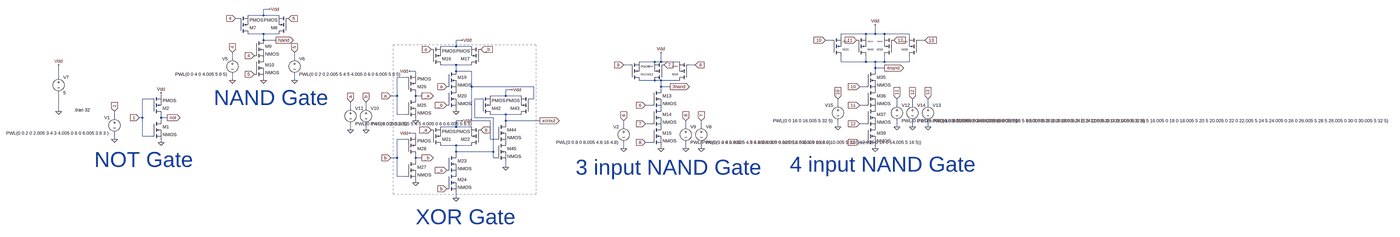
[diagram p0: schematic Basic Gates using CMOS.asc, whole sheet]
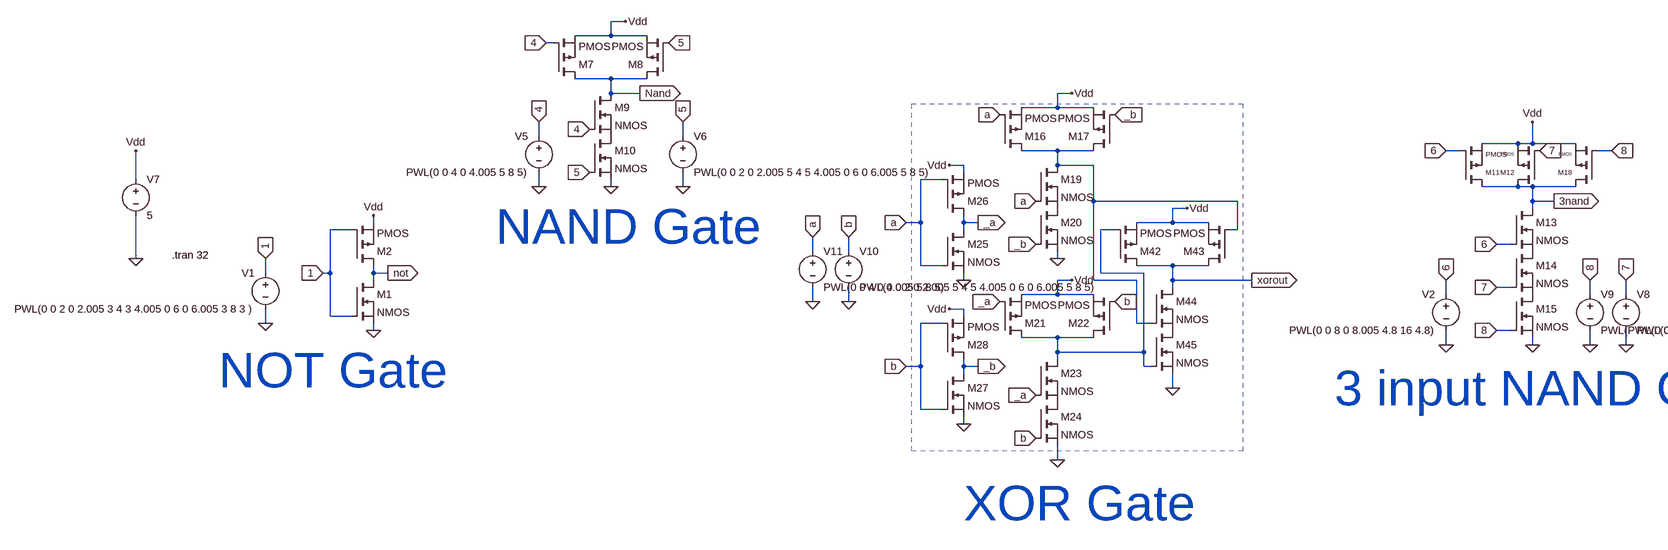
[diagram p1: schematic Basic Gates using CMOS.asc, part, row 1 of 1, column 1 of 2]
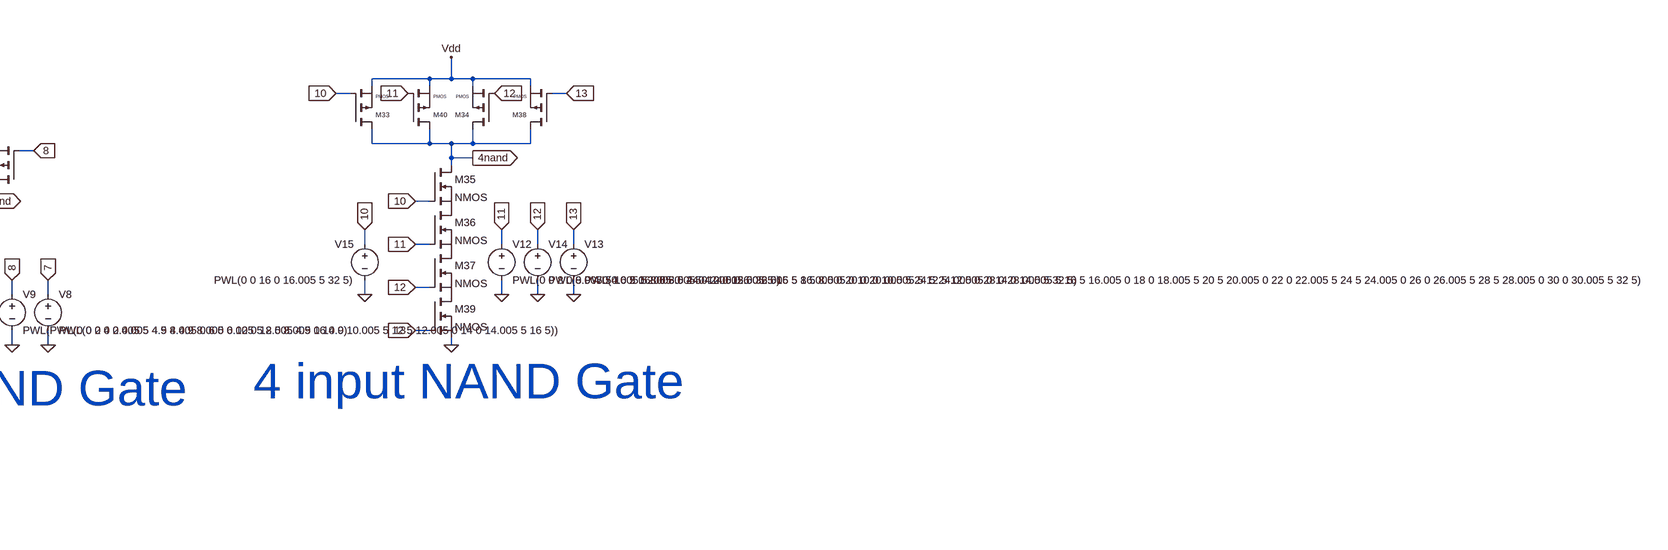
[diagram p2: schematic Basic Gates using CMOS.asc, part, row 1 of 1, column 2 of 2]
Basic Gates using CMOS.asc, the LTspice schematic file:
Version 4
SHEET 1 7632 1456
WIRE 1456 -784 1424 -784
WIRE 1424 -752 1424 -784
WIRE 1424 -752 1344 -752
WIRE 1504 -752 1424 -752
WIRE 1296 -736 1280 -736
WIRE 1424 -656 1344 -656
WIRE 1504 -656 1424 -656
WIRE 4528 -656 4400 -656
WIRE 4576 -656 4576 -704
WIRE 4576 -656 4528 -656
WIRE 4624 -656 4576 -656
WIRE 4752 -656 4624 -656
WIRE 4400 -640 4400 -656
WIRE 4528 -640 4528 -656
WIRE 4624 -640 4624 -656
WIRE 4752 -640 4752 -656
WIRE 1424 -624 1424 -656
WIRE 1488 -624 1424 -624
WIRE 2448 -624 2416 -624
WIRE 4352 -624 4320 -624
WIRE 4832 -624 4800 -624
WIRE 2416 -592 2416 -624
WIRE 2416 -592 2336 -592
WIRE 2496 -592 2416 -592
WIRE 1264 -528 1264 -560
WIRE 1584 -528 1584 -560
WIRE 3440 -512 3360 -512
WIRE 3472 -512 3472 -560
WIRE 3472 -512 3440 -512
WIRE 3568 -512 3472 -512
WIRE 4400 -512 4400 -544
WIRE 4528 -512 4528 -544
WIRE 4528 -512 4400 -512
WIRE 4576 -512 4528 -512
WIRE 4624 -512 4624 -544
WIRE 4624 -512 4576 -512
WIRE 4752 -512 4752 -544
WIRE 4752 -512 4624 -512
WIRE 2416 -496 2336 -496
WIRE 2496 -496 2416 -496
WIRE 3312 -496 3280 -496
WIRE 3648 -496 3616 -496
WIRE 4576 -480 4576 -512
WIRE 4624 -480 4576 -480
WIRE 2208 -464 2176 -464
WIRE 2416 -464 2416 -496
WIRE 2496 -464 2416 -464
WIRE 4576 -464 4576 -480
WIRE 2208 -448 2208 -464
WIRE 368 -432 368 -496
WIRE 2160 -432 2112 -432
WIRE 1264 -416 1264 -448
WIRE 1424 -416 1424 -432
WIRE 1584 -416 1584 -448
WIRE 3440 -416 3360 -416
WIRE 3472 -416 3440 -416
WIRE 3568 -416 3472 -416
WIRE 2496 -384 2496 -464
WIRE 2816 -384 2496 -384
WIRE 3472 -384 3472 -416
WIRE 3520 -384 3472 -384
WIRE 4528 -384 4496 -384
WIRE 2704 -368 2672 -368
WIRE 3472 -368 3472 -384
WIRE 896 -336 896 -352
WIRE 2112 -336 2112 -432
WIRE 2112 -336 2080 -336
WIRE 2208 -336 2208 -352
WIRE 2240 -336 2208 -336
WIRE 2672 -336 2672 -368
WIRE 2672 -336 2592 -336
WIRE 2752 -336 2672 -336
WIRE 848 -320 800 -320
WIRE 2208 -320 2208 -336
WIRE 2544 -320 2512 -320
WIRE 2816 -320 2816 -384
WIRE 2816 -320 2800 -320
WIRE 3424 -288 3392 -288
WIRE 4384 -288 4384 -320
WIRE 4528 -288 4496 -288
WIRE 4688 -288 4688 -320
WIRE 4768 -288 4768 -320
WIRE 4848 -288 4848 -320
WIRE 1872 -272 1872 -304
WIRE 1952 -272 1952 -304
WIRE 368 -256 368 -352
WIRE 2416 -256 2416 -272
WIRE 2112 -240 2112 -336
WIRE 2160 -240 2112 -240
WIRE 2672 -240 2592 -240
WIRE 2752 -240 2672 -240
WIRE 656 -224 656 -256
WIRE 800 -224 800 -320
WIRE 800 -224 784 -224
WIRE 896 -224 896 -240
WIRE 928 -224 896 -224
WIRE 2512 -224 2512 -320
WIRE 2608 -224 2512 -224
WIRE 896 -208 896 -224
WIRE 2208 -208 2208 -224
WIRE 2448 -208 2416 -208
WIRE 2496 -208 2496 -384
WIRE 2592 -208 2496 -208
WIRE 2672 -208 2672 -240
WIRE 2848 -208 2672 -208
WIRE 2672 -192 2672 -208
WIRE 3424 -192 3392 -192
WIRE 4528 -192 4496 -192
WIRE 2416 -176 2416 -208
WIRE 2416 -176 2336 -176
WIRE 2496 -176 2416 -176
WIRE 3280 -176 3280 -208
WIRE 3600 -176 3600 -208
WIRE 3680 -176 3680 -208
WIRE 4384 -176 4384 -208
WIRE 4688 -176 4688 -208
WIRE 4768 -176 4768 -208
WIRE 4848 -176 4848 -208
WIRE 1872 -160 1872 -192
WIRE 1952 -160 1952 -192
WIRE 2208 -144 2176 -144
WIRE 800 -128 800 -224
WIRE 848 -128 800 -128
WIRE 2208 -128 2208 -144
WIRE 656 -112 656 -144
WIRE 2160 -112 2112 -112
WIRE 2592 -112 2592 -208
WIRE 2624 -112 2592 -112
WIRE 896 -96 896 -112
WIRE 3424 -96 3392 -96
WIRE 4528 -96 4496 -96
WIRE 2416 -80 2336 -80
WIRE 2496 -80 2416 -80
WIRE 3280 -64 3280 -96
WIRE 3472 -64 3472 -80
WIRE 3600 -64 3600 -96
WIRE 3680 -64 3680 -96
WIRE 4576 -64 4576 -80
WIRE 2416 -48 2416 -80
WIRE 2608 -48 2608 -224
WIRE 2608 -48 2416 -48
WIRE 2416 -32 2416 -48
WIRE 2112 -16 2112 -112
WIRE 2112 -16 2080 -16
WIRE 2208 -16 2208 -32
WIRE 2240 -16 2208 -16
WIRE 2608 -16 2608 -48
WIRE 2624 -16 2608 -16
WIRE 2208 0 2208 -16
WIRE 2672 32 2672 0
WIRE 2112 80 2112 -16
WIRE 2160 80 2112 80
WIRE 2208 112 2208 96
WIRE 2416 192 2416 160
FLAG 1264 -416 0
FLAG 1584 -416 0
FLAG 1264 -560 4
IOPIN 1264 -560 In
FLAG 1584 -560 5
IOPIN 1584 -560 In
FLAG 896 -96 0
FLAG 896 -352 Vdd
FLAG 928 -224 not
IOPIN 928 -224 Out
FLAG 784 -224 1
IOPIN 784 -224 In
FLAG 656 -112 0
FLAG 656 -256 1
IOPIN 656 -256 In
FLAG 368 -256 0
FLAG 368 -496 Vdd
FLAG 3280 -64 0
FLAG 3680 -64 0
FLAG 3280 -208 6
IOPIN 3280 -208 In
FLAG 3680 -208 7
IOPIN 3680 -208 In
FLAG 3600 -64 0
FLAG 3600 -208 8
IOPIN 3600 -208 In
FLAG 1952 -160 0
FLAG 1952 -304 b
IOPIN 1952 -304 In
FLAG 1872 -160 0
FLAG 1872 -304 a
IOPIN 1872 -304 In
FLAG 3472 -560 Vdd
FLAG 3280 -496 6
IOPIN 3280 -496 In
FLAG 3488 -496 7
IOPIN 3488 -496 In
FLAG 3520 -384 3nand
IOPIN 3520 -384 Out
FLAG 3392 -192 7
IOPIN 3392 -192 In
FLAG 3392 -288 6
IOPIN 3392 -288 In
FLAG 3472 -64 0
FLAG 3392 -96 8
IOPIN 3392 -96 In
FLAG 3648 -496 8
IOPIN 3648 -496 In
FLAG 4688 -176 0
FLAG 4848 -176 0
FLAG 4688 -320 11
IOPIN 4688 -320 In
FLAG 4848 -320 13
IOPIN 4848 -320 In
FLAG 4768 -176 0
FLAG 4768 -320 12
IOPIN 4768 -320 In
FLAG 4576 -704 Vdd
FLAG 4320 -624 10
IOPIN 4320 -624 In
FLAG 4672 -624 12
IOPIN 4672 -624 In
FLAG 4624 -480 4nand
IOPIN 4624 -480 Out
FLAG 4496 -288 11
IOPIN 4496 -288 In
FLAG 4496 -384 10
IOPIN 4496 -384 In
FLAG 4496 -192 12
IOPIN 4496 -192 In
FLAG 4832 -624 13
IOPIN 4832 -624 In
FLAG 4384 -176 0
FLAG 4384 -320 10
IOPIN 4384 -320 In
FLAG 4576 -64 0
FLAG 4496 -96 13
IOPIN 4496 -96 In
FLAG 4480 -624 11
IOPIN 4480 -624 In
FLAG 2448 -624 Vdd
FLAG 2416 -256 0
FLAG 2368 -288 _b
IOPIN 2368 -288 In
FLAG 2368 -384 a
IOPIN 2368 -384 In
FLAG 2288 -576 a
IOPIN 2288 -576 In
FLAG 2544 -576 _b
IOPIN 2544 -576 In
FLAG 2448 -208 Vdd
FLAG 2416 192 0
FLAG 2368 144 b
IOPIN 2368 144 In
FLAG 2368 48 _a
IOPIN 2368 48 In
FLAG 2288 -160 _a
IOPIN 2288 -160 In
FLAG 2544 -160 b
IOPIN 2544 -160 In
FLAG 2848 -208 xorout
IOPIN 2848 -208 Out
FLAG 2208 -208 0
FLAG 2176 -464 Vdd
FLAG 2240 -336 _a
IOPIN 2240 -336 Out
FLAG 2080 -336 a
IOPIN 2080 -336 In
FLAG 2208 112 0
FLAG 2176 -144 Vdd
FLAG 2240 -16 _b
IOPIN 2240 -16 Out
FLAG 2080 -16 b
IOPIN 2080 -16 In
FLAG 2704 -368 Vdd
FLAG 2672 32 0
FLAG 1456 -784 Vdd
FLAG 1424 -416 0
FLAG 1376 -544 4
IOPIN 1376 -544 In
FLAG 1552 -736 5
IOPIN 1552 -736 In
FLAG 1376 -448 5
IOPIN 1376 -448 In
FLAG 1280 -736 4
IOPIN 1280 -736 In
FLAG 1488 -624 Nand
IOPIN 1488 -624 Out
SYMBOL voltage 1264 -544 M0
SYMATTR InstName V5
SYMATTR Value PWL(0 0 4 0 4.005 5 8 5)
SYMBOL voltage 1584 -544 R0
SYMATTR InstName V6
SYMATTR Value PWL(0 0 2 0 2.005 5 4 5 4.005 0 6 0 6.005 5 8 5)
SYMBOL nmos 848 -208 R0
SYMATTR InstName M1
SYMBOL pmos 848 -240 M180
SYMATTR InstName M2
SYMBOL voltage 656 -240 M0
SYMATTR InstName V1
SYMATTR Value PWL(0 0 2 0 2.005 3 4 3 4.005 0 6 0 6.005 3 8 3 )
SYMBOL voltage 368 -448 R0
SYMATTR InstName V7
SYMATTR Value 5
SYMBOL voltage 3280 -192 M0
SYMATTR InstName V2
SYMATTR Value PWL(0 0 8 0 8.005 4.8 16 4.8)
SYMBOL voltage 3680 -192 R0
SYMATTR InstName V8
SYMATTR Value PWL(0 0 4 0 4.005 4.9 8 4.9 8.005 0 12 0 12.005 4.9 16 4.9)
SYMBOL voltage 3600 -192 R0
SYMATTR InstName V9
SYMATTR Value PWL(PWL(0 0 2 0 2.005 5 4 5 4.005 0 6 0 6.005 5 8 5 8.005 0 10 0 10.005 5 12 5 12.005 0 14 0 14.005 5 16 5))
SYMBOL voltage 1952 -288 R0
SYMATTR InstName V10
SYMATTR Value PWL(0 0 2 0 2.005 5 4 5 4.005 0 6 0 6.005 5 8 5)
SYMBOL voltage 1872 -288 R0
SYMATTR InstName V11
SYMATTR Value PWL(0 0 4 0 4.005 5 8 5)
SYMBOL pmos 3312 -416 M180
WINDOW 0 56 32 Left 1
WINDOW 3 56 72 Left 1
SYMATTR InstName M11
SYMBOL pmos 3488 -416 R180
WINDOW 0 56 32 Left 1
WINDOW 3 56 72 Left 0
SYMATTR InstName M12
SYMBOL nmos 3424 -368 R0
SYMATTR InstName M13
SYMBOL nmos 3424 -272 R0
SYMATTR InstName M14
SYMBOL nmos 3424 -176 R0
SYMATTR InstName M15
SYMBOL pmos 3616 -416 R180
WINDOW 0 56 32 Left 1
WINDOW 3 56 72 Left 0
SYMATTR InstName M18
SYMBOL voltage 4688 -304 R0
SYMATTR InstName V12
SYMATTR Value PWL(0 0 8 0 8.005 5 16 5 16.005 0  24 0 24.005 5 32 5)
SYMBOL voltage 4848 -304 R0
SYMATTR InstName V13
SYMATTR Value PWL(0 0 2 0 2.005 5 4 5 4.005 0 6 0 6.005 5 8 5 8.005 0 10 0 10.005 5 12 5 12.005 0 14 0 14.005 5 16 5 16.005 0 18 0 18.005 5 20 5 20.005 0 22 0 22.005 5 24 5 24.005 0 26 0 26.005 5 28 5 28.005 0 30 0 30.005 5 32 5)
SYMBOL voltage 4768 -304 R0
SYMATTR InstName V14
SYMATTR Value PWL(0 0 4 0 4.005 5 8 5 8.005 0 12 0 12.005 5 16 5 16.005 0 20 0 20.005 5 24 5 24.005 0 28 0 28.005 5 32 5)
SYMBOL pmos 4352 -544 M180
WINDOW 0 56 32 Left 1
WINDOW 3 56 72 Left 0
SYMATTR InstName M33
SYMBOL pmos 4672 -544 R180
WINDOW 0 56 32 Left 1
WINDOW 3 56 72 Left 0
SYMATTR InstName M34
SYMBOL nmos 4528 -464 R0
SYMATTR InstName M35
SYMBOL nmos 4528 -368 R0
SYMATTR InstName M36
SYMBOL nmos 4528 -272 R0
SYMATTR InstName M37
SYMBOL pmos 4800 -544 R180
WINDOW 0 56 32 Left 1
WINDOW 3 56 72 Left 0
SYMATTR InstName M38
SYMBOL voltage 4384 -304 M0
SYMATTR InstName V15
SYMATTR Value PWL(0 0 16 0 16.005 5 32 5)
SYMBOL nmos 4528 -176 R0
SYMATTR InstName M39
SYMBOL pmos 4480 -544 M180
WINDOW 0 56 32 Left 1
WINDOW 3 56 72 Left 0
SYMATTR InstName M40
SYMBOL pmos 2288 -496 M180
SYMATTR InstName M16
SYMBOL pmos 2544 -496 R180
SYMATTR InstName M17
SYMBOL nmos 2368 -464 R0
SYMATTR InstName M19
SYMBOL nmos 2368 -368 R0
SYMATTR InstName M20
SYMBOL pmos 2288 -80 M180
SYMATTR InstName M21
SYMBOL pmos 2544 -80 R180
SYMATTR InstName M22
SYMBOL nmos 2368 -32 R0
SYMATTR InstName M23
SYMBOL nmos 2368 64 R0
SYMATTR InstName M24
SYMBOL nmos 2160 -320 R0
SYMATTR InstName M25
SYMBOL pmos 2160 -352 M180
SYMATTR InstName M26
SYMBOL nmos 2160 0 R0
SYMATTR InstName M27
SYMBOL pmos 2160 -32 M180
SYMATTR InstName M28
SYMBOL pmos 2544 -240 M180
SYMATTR InstName M42
SYMBOL pmos 2800 -240 R180
SYMATTR InstName M43
SYMBOL nmos 2624 -192 R0
SYMATTR InstName M44
SYMBOL nmos 2624 -96 R0
SYMATTR InstName M45
SYMBOL pmos 1296 -656 M180
SYMATTR InstName M7
SYMBOL pmos 1552 -656 R180
SYMATTR InstName M8
SYMBOL nmos 1376 -624 R0
SYMATTR InstName M9
SYMBOL nmos 1376 -528 R0
SYMATTR InstName M10
TEXT 1168 -328 Left 7 ;NAND Gate
TEXT 552 -8 Left 7 ;NOT Gate
TEXT 448 -264 Left 2 !.tran 32
TEXT 3032 32 Left 7 ;3 input NAND Gate
TEXT 2208 288 Left 7 ;XOR Gate
TEXT 4136 16 Left 7 ;4 input NAND Gate
RECTANGLE Normal 2092 -600 2828 172 2

The netlist it stands for:
* Basic Gates using CMOS.asc
V5 4 0 PWL(0 0 4 0 4.005 5 8 5)
V6 5 0 PWL(0 0 2 0 2.005 5 4 5 4.005 0 6 0 6.005 5 8 5)
M1 not 1 0 0 NMOS
M2 not 1 Vdd Vdd PMOS
V1 1 0 PWL(0 0 2 0 2.005 3 4 3 4.005 0 6 0 6.005 3 8 3 )
V7 Vdd 0 5
V2 6 0 PWL(0 0 8 0 8.005 4.8 16 4.8)
V8 7 0 PWL(0 0 4 0 4.005 4.9 8 4.9 8.005 0 12 0 12.005 4.9 16 4.9)
V9 8 0 PWL(PWL(0 0 2 0 2.005 5 4 5 4.005 0 6 0 6.005 5 8 5 8.005 0 10 0 10.005 5 12 5 12.005 0 14 0 14.005 5 16 5))
V10 b 0 PWL(0 0 2 0 2.005 5 4 5 4.005 0 6 0 6.005 5 8 5)
V11 a 0 PWL(0 0 4 0 4.005 5 8 5)
M11 3nand 6 Vdd Vdd PMOS
M12 3nand 7 Vdd Vdd PMOS
M13 3nand 6 P001 P001 NMOS
M14 P001 7 P002 P002 NMOS
M15 P002 8 0 0 NMOS
M18 3nand 8 Vdd Vdd PMOS
V12 11 0 PWL(0 0 8 0 8.005 5 16 5 16.005 0  24 0 24.005 5 32 5)
V13 13 0 PWL(0 0 2 0 2.005 5 4 5 4.005 0 6 0 6.005 5 8 5 8.005 0 10 0 10.005 5 12 5 12.005 0 14 0 14.005 5 16 5 16.005 0 18 0 18.005 5 20 5 20.005 0 22 0 22.005 5 24 5 24.005 0 26 0 26.005 5 28 5 28.005 0 30 0 30.005 5 32 5)
V14 12 0 PWL(0 0 4 0 4.005 5 8 5 8.005 0 12 0 12.005 5 16 5 16.005 0 20 0 20.005 5 24 5 24.005 0 28 0 28.005 5 32 5)
M33 4nand 10 Vdd Vdd PMOS
M34 4nand 12 Vdd Vdd PMOS
M35 4nand 10 P003 P003 NMOS
M36 P003 11 P004 P004 NMOS
M37 P004 12 P005 P005 NMOS
M38 4nand 13 Vdd Vdd PMOS
V15 10 0 PWL(0 0 16 0 16.005 5 32 5)
M39 P005 13 0 0 NMOS
M40 4nand 11 Vdd Vdd PMOS
M16 N001 a Vdd Vdd PMOS
M17 N001 _b Vdd Vdd PMOS
M19 N001 a P006 P006 NMOS
M20 P006 _b 0 0 NMOS
M21 N002 _a Vdd Vdd PMOS
M22 N002 b Vdd Vdd PMOS
M23 N002 _a P007 P007 NMOS
M24 P007 b 0 0 NMOS
M25 _a a 0 0 NMOS
M26 _a a Vdd Vdd PMOS
M27 _b b 0 0 NMOS
M28 _b b Vdd Vdd PMOS
M42 xorout N002 Vdd Vdd PMOS
M43 xorout N001 Vdd Vdd PMOS
M44 xorout N001 P008 P008 NMOS
M45 P008 N002 0 0 NMOS
M7 Nand 4 Vdd Vdd PMOS
M8 Nand 5 Vdd Vdd PMOS
M9 Nand 4 P009 P009 NMOS
M10 P009 5 0 0 NMOS
.model NMOS NMOS
.model PMOS PMOS
.lib standard.mos
* NAND Gate
* NOT Gate
.tran 32
* 3 input NAND Gate
* XOR Gate
* 4 input NAND Gate
.backanno
.end